# Altium project MotorTreiber.PrjPcb
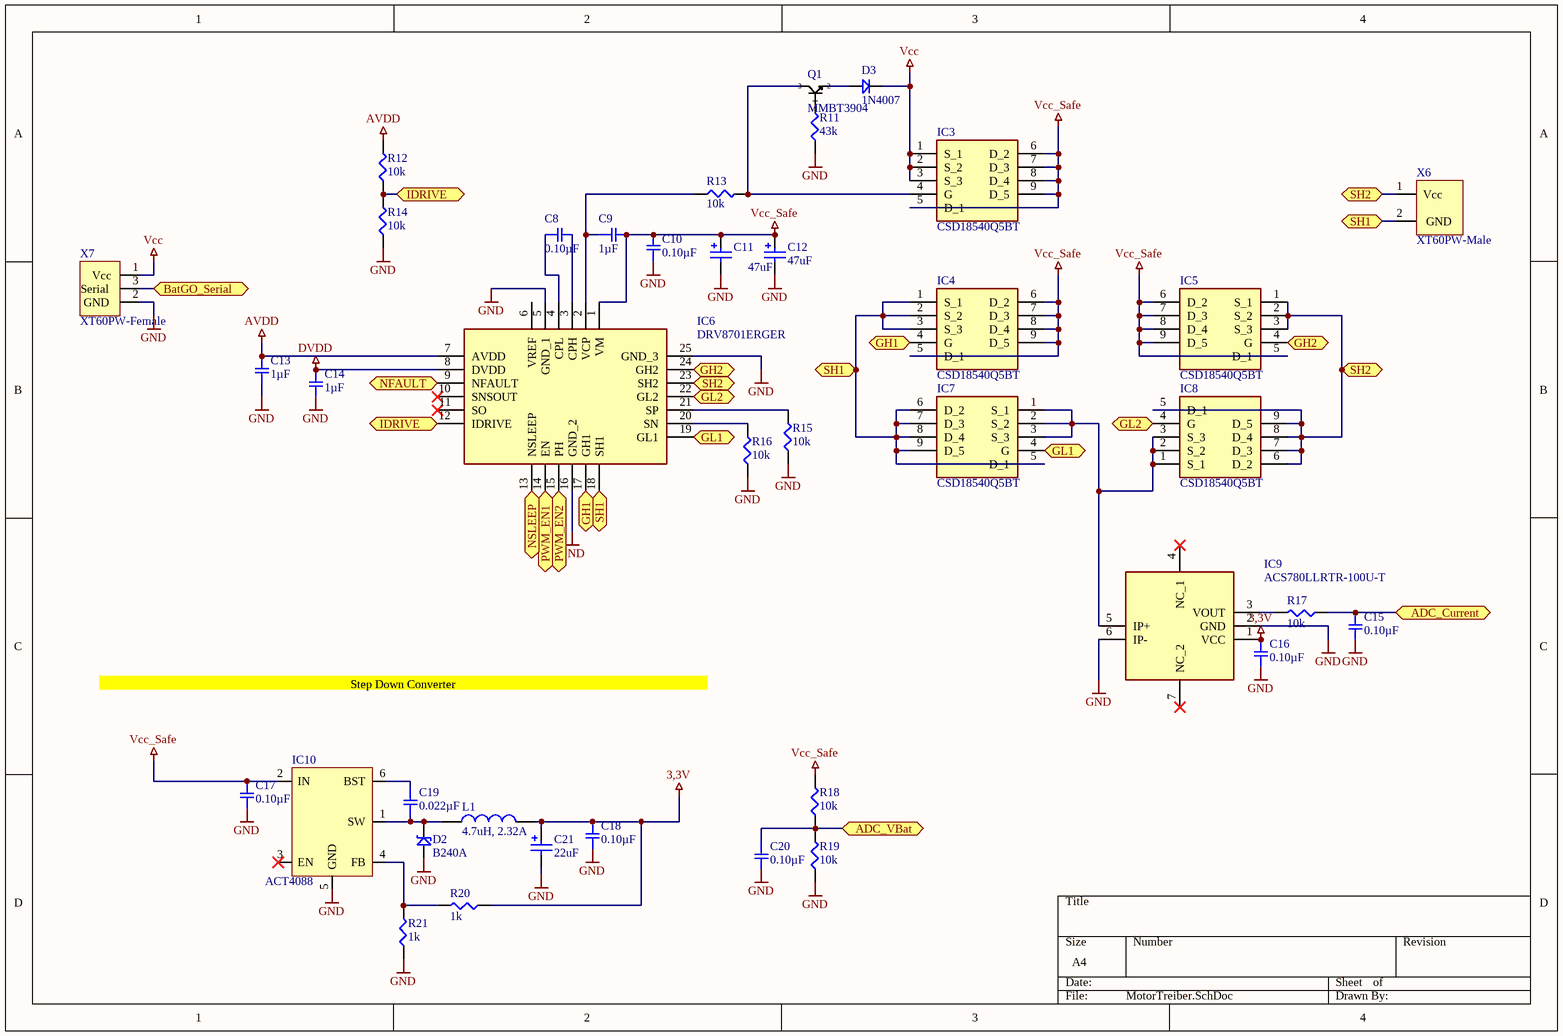
[diagram p0: MotorTreiber.SchDoc]
2 sheets, 73 parts. Net scope: flat (ports and power ports of the same name join across sheets).
Board file: Motortreiber.PcbDoc
Sheets:
  MotorTreiber.SchDoc
  MotorTreiber-µC.SchDoc

## Sheet MotorTreiber.SchDoc
size A4

### Parts
C8  0.10µF  [SMD-0402C]
C9  1µF  [SMD-0402C]
C10  0.10µF  [SMD-0402C]
C11  value 47uF  [WCAP-ASLI_6.3x7.7]  (hidden comment: 865080645012)
C12  value 47uF  [WCAP-ASLI_6.3x7.7]  (hidden comment: 865080645012)
C13  1µF  [SMD-0402C]
C14  1µF  [SMD-0402C]
C15  0.10µF  [SMD-0402C]
C16  0.10µF  [SMD-0402C]
C17  0.10µF  [SMD-0402C]
C18  0.10µF  [SMD-0402C]
C19  0.022µF  [SMD-0603C]
C20  0.10µF  [SMD-0402C]
C21  value 22uF  [WCAP-ASLI_4x5.5]  (hidden comment: 865080140001)
D2  B240A  [B240A]
D3  1N4007  [SOD-323]
IC3  CSD18540Q5BT  [CSD18540Q5BT]
IC4  CSD18540Q5BT  [CSD18540Q5BT]
IC5  CSD18540Q5BT  [CSD18540Q5BT]
IC6  DRV8701ERGER  [QFN50P400X400X100-25N-D]
IC7  CSD18540Q5BT  [CSD18540Q5BT]
IC8  CSD18540Q5BT  [CSD18540Q5BT]
IC9  ACS780LLRTR-100U-T  [7-PIN_PSOF]
IC10  ACT4088  [SOT23-6]
L1  4.7uH, 2.32A  [WE-PD_7332]
Q1  MMBT3904  [SOT23]
R11  43k  [SMD-0402-RES]
R12  10k  [SMD-0402-RES]
R13  10k  [SMD-0402-RES]
R14  10k  [SMD-0402-RES]
R15  10k  [SMD-0402-RES]
R16  10k  [SMD-0402-RES]
R17  10k  [SMD-0402-RES]
R18  10k  [SMD-0402-RES]
R19  10k  [SMD-0402-RES]
R20  1k  [SMD-0603-RES]
R21  1k  [SMD-0603-RES]
X6  XT60PW-Male  [XT60PW_Male]
X7  XT60PW-Female  [XT60PWI-M_Female]

### Ports
ADC_Current (bidir), ADC_VBat (bidir), BatGO_Serial (bidir), GH1 (bidir), GH2 (bidir), GL1 (bidir), GL2 (bidir), IDRIVE (bidir), NFAULT (bidir), NSLEEP (bidir), PWM_EN1 (bidir), PWM_EN2 (bidir), SH1 (bidir), SH2 (bidir)

### Nets
3,3V: C16.1 C18.1 C21.1(P) IC9.1(VCC) L1.2 R20.1
AVDD: C13.1 IC6.7(AVDD) R12.2
DVDD: C14.1 IC6.8(DVDD)
GND: C10.1 C11.2(N) C12.2(N) C13.2 C14.2 C15.2 C16.2 C17.2 C18.2 C20.2 C21.2(N) D2.A IC6.5(GND_1) IC6.16(GND_2) IC6.25(GND_3) IC9.2(GND) IC9.6(IP-) IC10.5(GND) R11.1 R14.1 R15.1 R16.1 R19.1 R21.1 X7.2(GND)
Vcc: D3.K IC3.1(S_1) IC3.2(S_2) IC3.3(S_3) X7.1(Vcc)
Vcc_Safe: C9.2 C10.2 C11.1(P) C12.1(P) C17.1 IC3.5(D_1) IC3.6(D_2) IC3.7(D_3) IC3.8(D_4) IC3.9(D_5) IC4.5(D_1) IC4.6(D_2) IC4.7(D_3) IC4.8(D_4) IC4.9(D_5) IC5.5(D_1) IC5.6(D_2) IC5.7(D_3) IC5.8(D_4) IC5.9(D_5) IC6.1(VM) IC10.2(IN) R18.2
NetC8_1: C8.1 IC6.4(CPL)
NetC8_2: C8.2 IC6.3(CPH)
NetC9_1: C9.1 IC6.2(VCP) R13.1
NetC15_1: C15.1 R17.1 ; port ADC_Current
NetC19_1: C19.1 IC10.6(BST)
NetC19_2: C19.2 D2.K IC10.1(SW) L1.1
NetC20_1: C20.1 R18.1 R19.2 ; port ADC_VBat
NetD3_A: D3.A Q1.S(2)
NetIC2_13: IC6.15(PH) ; port PWM_EN2
NetIC2_14: IC6.14(EN) ; port PWM_EN1
NetIC2_15: IC6.13(NSLEEP) ; port NSLEEP
NetIC2_16: IC6.9(NFAULT) ; port NFAULT
NetIC2_21: X7.3(Serial) ; port BatGO_Serial
NetIC3_4: IC3.4(G) Q1.D(3) R13.2
NetIC4_1: IC4.1(S_1) IC4.2(S_2) IC4.3(S_3) IC6.18(SH1) IC7.5(D_1) IC7.6(D_2) IC7.7(D_3) IC7.8(D_4) IC7.9(D_5) X6.2(GND) ; port SH1
NetIC4_4: IC4.4(G) IC6.17(GH1) ; port GH1
NetIC5_1: IC5.1(S_1) IC5.2(S_2) IC5.3(S_3) IC6.23(SH2) IC8.5(D_1) IC8.6(D_2) IC8.7(D_3) IC8.8(D_4) IC8.9(D_5) X6.1(Vcc) ; port SH2
NetIC5_4: IC5.4(G) IC6.24(GH2) ; port GH2
NetIC6_12: IC6.12(IDRIVE) R12.1 R14.2 ; port IDRIVE
NetIC6_19: IC6.19(GL1) IC7.4(G) ; port GL1
NetIC6_20: IC6.20(SN) R16.2
NetIC6_21: IC6.21(SP) R15.2
NetIC6_22: IC6.22(GL2) IC8.4(G) ; port GL2
NetIC7_1: IC7.1(S_1) IC7.2(S_2) IC7.3(S_3) IC8.1(S_1) IC8.2(S_2) IC8.3(S_3) IC9.5(IP+)
NetIC9_3: IC9.3(VOUT) R17.2
NetIC10_4: IC10.4(FB) R20.2 R21.2
NetQ1_G: Q1.G(1) R11.2

Not connected (* = marked no-connect by the designer): IC6 6(VREF) 10(SNSOUT)* 11(SO)*; IC9 4(NC_1)* 7(NC_2)*; IC10 3(EN)*

### Notes on the sheet
- Step Down Converter

### Library data of the parts
C8 C10 C15-C18 C20 = GCM155R71C104KA55D: CAP CER 0.1UF 16V X7R 0402; Manufacturer: Murata Electronics North America; Factory Stock: 0; Unit Price (USD): 0.1; Minimum Quantity: 1; Tolerance: ±10%; Datasheets: http://www.murata.com/~/media/webrenewal/support/library/catalog/products/capacitor/mlcc/c03e.ashx; Image: //media.digikey.com/Renders/Murata%20Renders/ZRB-SERIES-0402.jpg; Digi-Key Part Number: 490-4759-1-ND; Part Number: GCM155R71C104KA55D; Quantity Available: 734194; @ qty: 0; Packaging: Cut Tape (CT); Series: GCM; Part Status: Active; Value: 0.10µF; Voltage: 16V; Temperature Coefficient: X7R; Operating Temperature: -55°C ~ 125°C; Features: -; Ratings: AEC-Q200; Applications: Automotive; Mounting Type: Surface Mount, MLCC; Package / Case: 0402 (1005 Metric); Size / Dimension: 0.039" L x 0.020" W (1.00mm x 0.50mm); Height - Seated (Max): -; Thickness (Max): 0.022" (0.55mm); Lead Spacing: -; Lead Style: -
C9 C13 C14 = GRM155C80J105KE02D: CAP CER 1UF 6.3V X6S 0402; Manufacturer: Murata Electronics North America; Factory Stock: 0; Unit Price (USD): 0.1; Minimum Quantity: 1; Tolerance: ±10%; Datasheets: http://www.murata.com/~/media/webrenewal/support/library/catalog/products/capacitor/mlcc/c02e.pdf; Image: //media.digikey.com/Renders/Murata%20Renders/ZRB-SERIES-0402.jpg; Digi-Key Part Number: 490-10433-1-ND; Part Number: GRM155C80J105KE02D; Quantity Available: 34510; @ qty: 0; Packaging: Cut Tape (CT); Series: GRM; Part Status: Active; Value: 1µF; Voltage: 6.3V; Temperature Coefficient: X6S; Operating Temperature: -55°C ~ 105°C; Features: Derating Recommended; Ratings: -; Applications: General Purpose; Mounting Type: Surface Mount, MLCC; Package / Case: 0402 (1005 Metric); Size / Dimension: 0.039" L x 0.020" W (1.00mm x 0.50mm); Height - Seated (Max): -; Thickness (Max): 0.022" (0.55mm); Lead Spacing: -; Lead Style: -
C11 C12 = 865080645012: WCAP-ASLI Aluminum Electrolytic Capacitors, size Ф6.3x7.7mm, 50V DC, 47uF; Rated Voltage: 50V DC; ComponentLink1Description: Manufacturer; ComponentLink1URL: http://www.we-online.de; ComponentLink2Description: Datasheet; ComponentLink2URL: http://katalog.we-online.de/pbs/datasheet/865080645012.pdf; Part Number: 865080645012; Published Date: June 2017; Publisher: Wurth Elektronik; Size: Ф6.3x7.7mm; Life Cycle: 2000h; Operating Temperature: -55 °C up to +105 °C
C19 = GCJ188R71H223KA01D: CAP CER 0.022UF 50V X7R 0603; Manufacturer: Murata Electronics North America; Factory Stock: 0; Unit Price (USD): 0.22; Minimum Quantity: 1; Tolerance: ±10%; Datasheets: http://www.murata.com/~/media/webrenewal/support/library/catalog/products/capacitor/mlcc/c03e.ashx; Image: //media.digikey.com/Renders/Murata%20Renders/0603%28LQG18%29.jpg; Digi-Key Part Number: 490-5851-1-ND; Part Number: GCJ188R71H223KA01D; Quantity Available: 7651; @ qty: 0; Packaging: Cut Tape (CT); Series: GCJ; Part Status: Active; Value: 0.022µF; Voltage: 50V; Temperature Coefficient: X7R; Operating Temperature: -55°C ~ 125°C; Features: Soft Termination; Ratings: AEC-Q200; Applications: Automotive, Boardflex Sensitive; Mounting Type: Surface Mount, MLCC; Package / Case: 0603 (1608 Metric); Size / Dimension: 0.063" L x 0.031" W (1.60mm x 0.80mm); Height - Seated (Max): -; Thickness (Max): 0.031" (0.80mm); Lead Spacing: -; Lead Style: -
C21 = 865080140001: WCAP-ASLI Aluminum Electrolytic Capacitors, size Ф4x5.5mm, 6.3V DC, 22uF; Rated Voltage: 6.3V DC; ComponentLink1Description: Manufacturer; ComponentLink1URL: http://www.we-online.de; ComponentLink2Description: Datasheet; ComponentLink2URL: http://katalog.we-online.de/pbs/datasheet/865080140001.pdf; Part Number: 865080140001; Published Date: June 2017; Publisher: Wurth Elektronik; Size: Ф4x5.5mm; Life Cycle: 2000h; Operating Temperature: -55 °C up to +105 °C
D2 = B240A: Shottkydiode
IC3-IC5 IC7 IC8 = CSD18540Q5BT: Integrated Circuit; Manufacturer_Name: Texas Instruments; Datasheet Link: http://www.ti.com/lit/gpn/CSD18540Q5B; Height: 1.05mm; Manufacturer_Part_Number: CSD18540Q5BT; Arrow Part Number: CSD18540Q5BT; Arrow Price/Stock: https://www.arrow.com/en/products/csd18540q5bt/texas-instruments; Mouser Part Number: 595-CSD18540Q5BT; Mouser Price/Stock: https://www.mouser.co.uk/ProductDetail/Texas-Instruments/CSD18540Q5BT?qs=NRIcxvoDUteGYlfdfF0DmQ%3D%3D
IC6 = DRV8701ERGER: Integrated Circuit; Manufacturer_Name: Texas Instruments; Datasheet Link: http://www.ti.com/lit/gpn/DRV8701; Height: 1mm; Manufacturer_Part_Number: DRV8701ERGER; Arrow Part Number: DRV8701ERGER; Arrow Price/Stock: https://www.arrow.com/en/products/drv8701erger/texas-instruments; Mouser Part Number: 595-DRV8701ERGER; Mouser Price/Stock: https://www.mouser.co.uk/ProductDetail/Texas-Instruments/DRV8701ERGER?qs=UfUFg%2FkmHHGO0gqJCiEBBQ%3D%3D
IC9 = ACS780LLRTR-100U-T: Integrated Circuit; Manufacturer_Name: Allegro Microsystems; Datasheet Link: https://www.allegromicro.com/~/media/Files/Datasheets/ACS780-Datasheet.ashx; Manufacturer_Part_Number: ACS780LLRTR-100U-T; Arrow Part Number: ACS780LLRTR-100U-T; Arrow Price/Stock: https://www.arrow.com/en/products/acs780llrtr-100u-t/allegro-microsystems
L1 = 744778004: WE-PD SMT Power Inductor, size 7332, 4.7uH, 2.32A; DC Resistance max.: 60mOhm; Self Resonant Frequency: 45MHz; Saturation Current: 4.2A; ComponentLink1Description: Manufacturer; ComponentLink1URL: http://www.we-online.de; ComponentLink2Description: Datasheet; ComponentLink2URL: https://katalog.we-online.com/pbs/datasheet/744778004.pdf; Part Number: 744778004; Published Date: April 2019; Publisher: Wurth Elektronik; Rated Current: 2.32A; Size: 7332; Inductance: 4.7uH; Operating Temperature: -40 to +125degC; Mounting Technology: SMT; Packaging: Tape and Reel
R11 = ERJ-2GEJ433X: RES SMD 43K OHM 5% 1/10W 0402; Manufacturer: Panasonic Electronic Components; Factory Stock: 0; Unit Price (USD): 0.00350; @ qty: 1500; Minimum Quantity: 1; Power (Watts): 0.1W, 1/10W; Temperature Coefficient: ±200ppm/°C; Part Number: ERJ-2GEJ433X; Datasheets: http://industrial.panasonic.com/www-cgi/jvcr13pz.cgi?E+PZ+3+AOA0001+ERJ2GEJ433X+7+WW; Image: //media.digikey.com/Photos/Panasonic%20Photos/ERJ-PA2-Series.jpg; Digi-Key Part Number: P43KJCT-ND; Quantity Available: 117636; Packaging: Cut Tape (CT); Series: ERJ; Part Status: Active; Value: 43k; Tolerance: ±5%; Composition: Thick Film; Features: Automotive AEC-Q200; Operating Temperature: -55°C ~ 155°C; Package / Case: 0402 (1005 Metric); Supplier Device Package: 0402; Size / Dimension: 0.039" L x 0.020" W (1.00mm x 0.50mm); Height - Seated (Max): 0.016" (0.40mm); Number of Terminations: 2; Failure Rate: -
R12-R19 = ERJ-2GEJ103X: RES SMD 10K OHM 5% 1/10W 0402; Manufacturer: Panasonic Electronic Components; Factory Stock: 0; Unit Price (USD): 0.00350; @ qty: 1500; Minimum Quantity: 1; Power (Watts): 0.1W, 1/10W; Temperature Coefficient: ±200ppm/°C; Part Number: ERJ-2GEJ103X; Datasheets: http://industrial.panasonic.com/www-cgi/jvcr13pz.cgi?E+PZ+3+AOA0001+ERJ2GEJ103X+7+WW; Image: //media.digikey.com/Photos/Panasonic%20Photos/ERJ-PA2-Series.jpg; Digi-Key Part Number: P10KJCT-ND; Quantity Available: 2560215; Packaging: Cut Tape (CT); Series: ERJ; Part Status: Active; Value: 10k; Tolerance: ±5%; Composition: Thick Film; Features: Automotive AEC-Q200; Operating Temperature: -55°C ~ 155°C; Package / Case: 0402 (1005 Metric); Supplier Device Package: 0402; Size / Dimension: 0.039" L x 0.020" W (1.00mm x 0.50mm); Height - Seated (Max): 0.016" (0.40mm); Number of Terminations: 2; Failure Rate: -
R20 R21 = ERJ-3EKF1001V: RES SMD 1K OHM 1% 1/10W 0603; Manufacturer: Panasonic Electronic Components; Factory Stock: 0; Unit Price (USD): 0.00379; @ qty: 1500; Minimum Quantity: 1; Power (Watts): 0.1W, 1/10W; Temperature Coefficient: ±100ppm/°C; Part Number: ERJ-3EKF1001V; Datasheets: http://industrial.panasonic.com/www-cgi/jvcr13pz.cgi?E+PZ+3+AOA0002+ERJ3EKF1001V+7+WW; Image: //media.digikey.com/Photos/Panasonic%20Photos/MFG_ERJ-P6W%20Series.jpg; Digi-Key Part Number: P1.00KHCT-ND; Quantity Available: 5218845; Packaging: Cut Tape (CT); Series: ERJ; Part Status: Active; Value: 1k; Tolerance: ±1%; Composition: Thick Film; Features: Automotive AEC-Q200; Operating Temperature: -55°C ~ 155°C; Package / Case: 0603 (1608 Metric); Supplier Device Package: 0603; Size / Dimension: 0.063" L x 0.031" W (1.60mm x 0.80mm); Height - Seated (Max): 0.022" (0.55mm); Number of Terminations: 2; Failure Rate: -

## Sheet MotorTreiber-µC.SchDoc
size A4
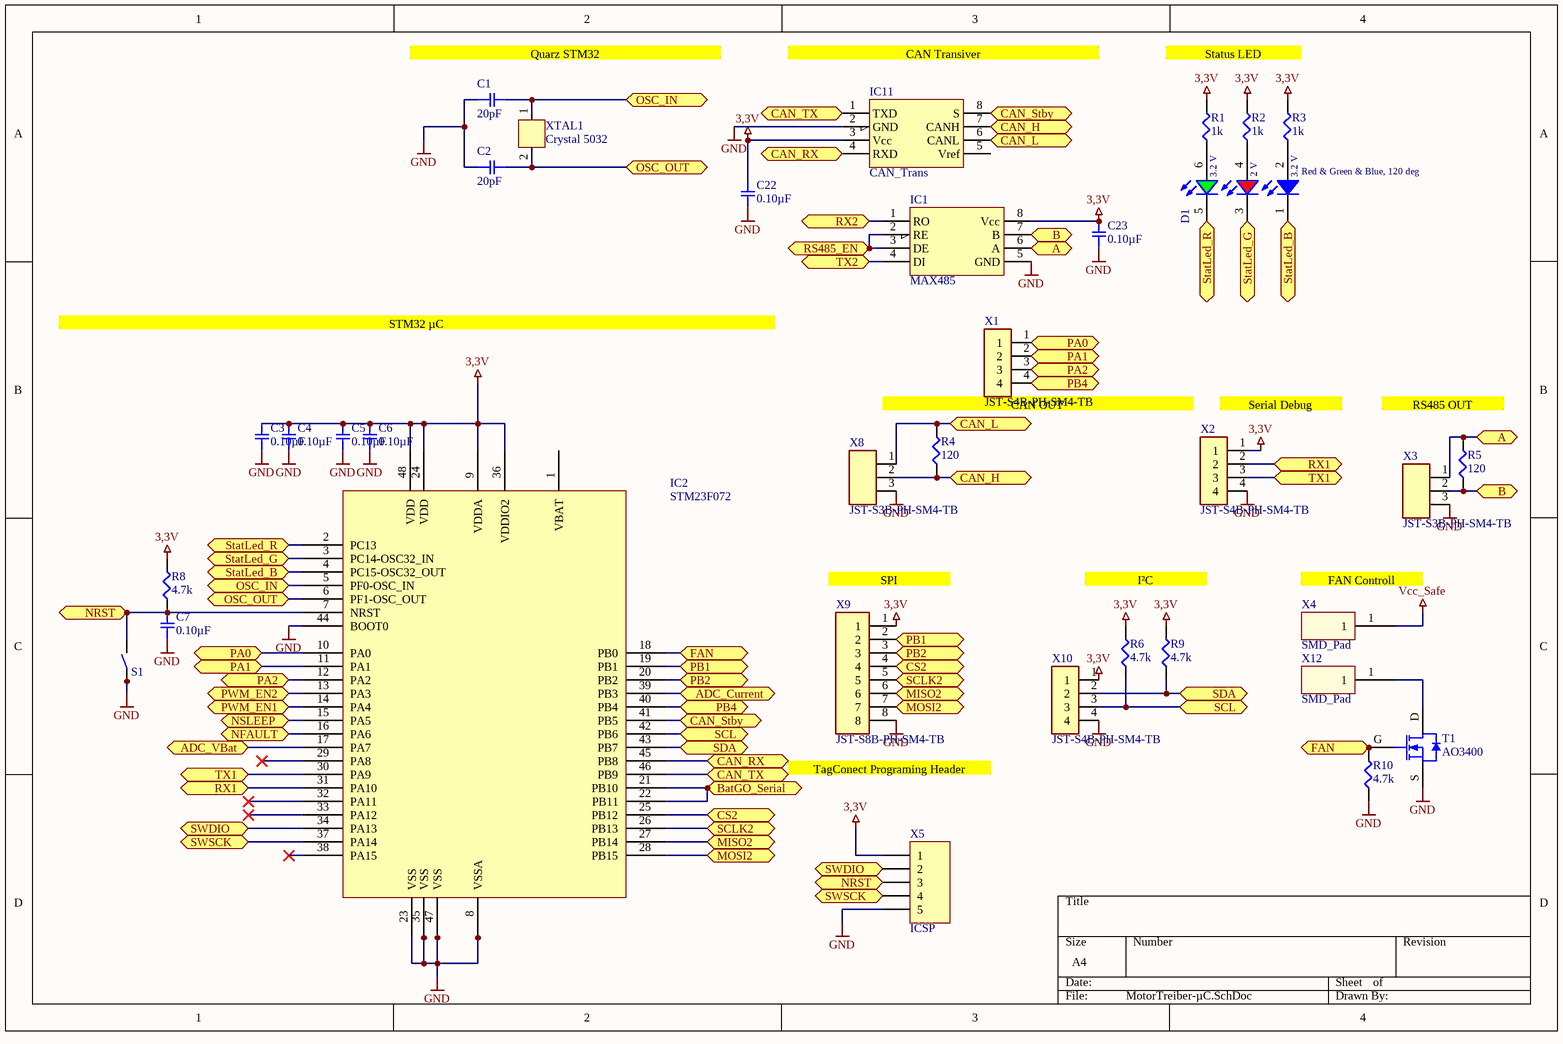
[diagram p1: MotorTreiber-µC.SchDoc]

### Parts
C1  20pF  [SMD-0402C]
C2  20pF  [SMD-0402C]
C3  0.10µF  [SMD-0402C]
C4  0.10µF  [SMD-0402C]
C5  0.10µF  [SMD-0402C]
C6  0.10µF  [SMD-0402C]
C7  0.10µF  [SMD-0402C]
C22  0.10µF  [SMD-0402C]
C23  0.10µF  [SMD-0402C]
D1  Red & Green & Blue, 120 deg  [WL-SFTW_3528_150352M173300]
IC1  MAX485  [D008_L]
IC2  STM23F072  [UFQFPN48]
IC11  CAN_Trans  [D008_L]
R1  1k  [SMD-0402-RES]
R2  1k  [SMD-0402-RES]
R3  1k  [SMD-0402-RES]
R4  120  [SMD-0402-RES]
R5  120  [SMD-0402-RES]
R6  4.7k  [SMD-0402-RES]
R8  4.7k  [SMD-0402-RES]
R9  4.7k  [SMD-0402-RES]
R10  4.7k  [SMD-0402-RES]
S1  Button  [Button5050]  (value not drawn)
T1  AO3400  [SOT23]
X1  JST-S4B-PH-SM4-TB  [JST-S4B-PH-SM4-TB]
X2  JST-S4B-PH-SM4-TB  [JST-S4B-PH-SM4-TB]
X3  JST-S3B-PH-SM4-TB  [JST-S3B-PH-SM4-TB]
X4  SMD_Pad  [SMD_Pad]
X5  ICSP  [TC2030-MCP-NL]
X8  JST-S3B-PH-SM4-TB  [JST-S3B-PH-SM4-TB]
X9  JST-S8B-PH-SM4-TB  [JST-S8B-PH-SM4-TB]
X10  JST-S4B-PH-SM4-TB  [JST-S4B-PH-SM4-TB]
X12  SMD_Pad  [SMD_Pad]
XTAL1  Crystal 5032  [5032]

### Ports
A (bidir), ADC_Current (bidir), ADC_VBat (bidir), B (bidir), BatGO_Serial (bidir), CAN_H (bidir), CAN_L (bidir), CAN_RX (bidir), CAN_Stby (bidir), CAN_TX (bidir), CS2 (bidir), FAN (bidir), MISO2 (bidir), MOSI2 (bidir), NFAULT (bidir), NRST (bidir), NSLEEP (bidir), OSC_IN (bidir), OSC_OUT (bidir), PA0 (bidir), PA1 (bidir), PA2 (bidir), PB1 (bidir), PB2 (bidir), PB4 (bidir), PWM_EN1 (bidir), PWM_EN2 (bidir), RS485_EN (bidir), RX1 (bidir), RX2 (bidir), SCL (bidir), SCLK2 (bidir), SDA (bidir), StatLed_B (bidir), StatLed_G (bidir), StatLed_R (bidir), SWDIO (bidir), SWSCK (bidir), TX1 (bidir), TX2 (bidir)

### Nets
3,3V: C3.2 C4.2 C5.2 C6.2 C22.2 C23.2 IC1.8(Vcc) IC2.9(VDDA) IC2.24(VDD) IC2.36(VDDIO2) IC2.48(VDD) IC11.3(Vcc) R1.2 R2.2 R3.2 R6.2 R8.2 R9.2 X2.1 X5.1 X9.1 X10.1
GND: C1.1 C2.1 C3.1 C4.1 C5.1 C6.1 C7.1 C22.1 C23.1 IC1.5(GND) IC2.8(VSSA) IC2.23(VSS) IC2.35(VSS) IC2.44(BOOT0) IC2.47(VSS) IC11.2(GND) R10.1 S1.1 T1.S X2.4 X3.3 X5.5 X8.3 X9.8 X10.4
Vcc_Safe: X4.1
NetC1_2: C1.2 IC2.5(PF0-OSC_IN) XTAL1.1 ; port OSC_IN
NetC2_2: C2.2 IC2.6(PF1-OSC_OUT) XTAL1.2 ; port OSC_OUT
NetC7_2: C7.2 IC2.7(NRST) R8.1 S1.2 X5.3 ; port NRST
NetC15_1: IC2.39(PB3) ; port ADC_Current
NetC20_1: IC2.17(PA7) ; port ADC_VBat
NetD1_1: D1.1(K) IC2.4(PC15-OSC32_OUT) ; port StatLed_B
NetD1_2: D1.2(A) R3.1
NetD1_3: D1.3(K) IC2.3(PC14-OSC32_IN) ; port StatLed_G
NetD1_4: D1.4(A) R2.1
NetD1_5: D1.5(K) IC2.2(PC13) ; port StatLed_R
NetD1_6: D1.6(A) R1.1
NetIC1_1: IC1.1(RO) ; port RX2
NetIC1_2: IC1.2(RE) IC1.3(DE) ; port RS485_EN
NetIC1_4: IC1.4(DI) ; port TX2
NetIC1_6: IC1.6(A) R5.2 X3.1 ; port A
NetIC1_7: IC1.7(B) R5.1 X3.2 ; port B
NetIC2_10: IC2.10(PA0) X1.1 ; port PA0
NetIC2_11: IC2.11(PA1) X1.2 ; port PA1
NetIC2_12: IC2.12(PA2) X1.3 ; port PA2
NetIC2_13: IC2.13(PA3) ; port PWM_EN2
NetIC2_14: IC2.14(PA4) ; port PWM_EN1
NetIC2_15: IC2.15(PA5) ; port NSLEEP
NetIC2_16: IC2.16(PA6) ; port NFAULT
NetIC2_18: IC2.18(PB0) R10.2 T1.G ; port FAN
NetIC2_19: IC2.19(PB1) X9.2 ; port PB1
NetIC2_20: IC2.20(PB2) X9.3 ; port PB2
NetIC2_21: IC2.21(PB10) IC2.22(PB11) ; port BatGO_Serial
NetIC2_25: IC2.25(PB12) X9.4 ; port CS2
NetIC2_26: IC2.26(PB13) X9.5 ; port SCLK2
NetIC2_27: IC2.27(PB14) X9.6 ; port MISO2
NetIC2_28: IC2.28(PB15) X9.7 ; port MOSI2
NetIC2_30: IC2.30(PA9) X2.3 ; port TX1
NetIC2_31: IC2.31(PA10) X2.2 ; port RX1
NetIC2_34: IC2.34(PA13) X5.2 ; port SWDIO
NetIC2_37: IC2.37(PA14) X5.4 ; port SWSCK
NetIC2_40: IC2.40(PB4) X1.4 ; port PB4
NetIC2_41: IC2.41(PB5) IC11.8(S) ; port CAN_Stby
NetIC2_42: IC2.42(PB6) R6.1 X10.3 ; port SCL
NetIC2_43: IC2.43(PB7) R9.1 X10.2 ; port SDA
NetIC2_45: IC2.45(PB8) IC11.4(RXD) ; port CAN_RX
NetIC2_46: IC2.46(PB9) IC11.1(TXD) ; port CAN_TX
NetIC11_6: IC11.6(CANL) R4.2 X8.1 ; port CAN_L
NetIC11_7: IC11.7(CANH) R4.1 X8.2 ; port CAN_H
NetT1_D: T1.D X12.1

Not connected (* = marked no-connect by the designer): IC2 1(VBAT) 29(PA8)* 32(PA11)* 33(PA12)* 38(PA15)*; IC11 5(Vref)

### Notes on the sheet
- Quarz STM32
- CAN Transiver
- Status LED
- STM32 µC
  STM32 µC
- (near X1) CAN OUT
- (near X2) Serial Debug
- (near R5) RS485 OUT
- (near X9) SPI
- I²C
- (near X4) FAN Controll
- (near X9) TagConect Programing Header
- (in symbol 150352M173300) 3.2 V; 2 V

### Library data of the parts
C1 C2 = GJM1555C1H200GB01D: CAP CER 20PF 50V NP0 0402; Manufacturer: Murata Electronics North America; Factory Stock: 0; Unit Price (USD): 0.2; Minimum Quantity: 1; Tolerance: ±2%; Temperature Coefficient: C0G, NP0; Datasheets: http://www.murata.com/~/media/webrenewal/support/library/catalog/products/capacitor/mlcc/c02e.pdf; Image: //media.digikey.com/Renders/Murata%20Renders/ZRB-SERIES-0402.jpg; Digi-Key Part Number: 490-8090-1-ND; Part Number: GJM1555C1H200GB01D; Quantity Available: 18876; @ qty: 0; Packaging: Cut Tape (CT); Series: GJM; Part Status: Active; Value: 20pF; Voltage: 50V; Operating Temperature: -55°C ~ 125°C; Features: High Q, Low Loss; Ratings: -; Applications: RF, Microwave, High Frequency; Mounting Type: Surface Mount, MLCC; Package / Case: 0402 (1005 Metric); Size / Dimension: 0.039" L x 0.020" W (1.00mm x 0.50mm); Height - Seated (Max): -; Thickness (Max): 0.022" (0.55mm); Lead Spacing: -; Lead Style: -
C3-C7 C22 C23 = GCM155R71C104KA55D: as C8 on sheet MotorTreiber; Datasheets: http://www.murata.com/~/media/webrenewal/support/library/catalog/products/capacitor/mlcc/c03e.ashx; Image: //media.digikey.com/Renders/Murata%20Renders/ZRB-SERIES-0402.jpg; Digi-Key Part Number: 490-4759-1-ND; Part Number: GCM155R71C104KA55D; Quantity Available: 734194; @ qty: 0; Packaging: Cut Tape (CT); Series: GCM; Part Status: Active; Value: 0.10µF; Voltage: 16V; Temperature Coefficient: X7R; Operating Temperature: -55°C ~ 125°C; Features: -; Ratings: AEC-Q200; Applications: Automotive; Mounting Type: Surface Mount, MLCC; Package / Case: 0402 (1005 Metric); Size / Dimension: 0.039" L x 0.020" W (1.00mm x 0.50mm); Height - Seated (Max): -; Thickness (Max): 0.022" (0.55mm); Lead Spacing: -; Lead Style: -
D1 = 150352M173300: SMT Full-color TOP LED Waterclear WL-SFTW, size 3528, Red & Green & Blue, 120 deg; Viewing Angle: 120 deg; Peak Wavelength: 465 nm@Blue, 515 nm@Green, 635 nm@Red; Dominant Wavelength: 470 nm@Blue, 520 nm@Green, 625 nm@Red; Luminous Intensity: 400 mcd@Blue, 1700 mcd@Green, 750 mcd@Red; Chip Technology: AlInGaP + InGaN; Forward Voltage: 3.2 V@Blue, 3.2 V@Green, 2 V@Red; ComponentLink1Description: Manufacturer; ComponentLink1URL: http://www.we-online.de; ComponentLink2Description: Datasheet; ComponentLink2URL: https://katalog.we-online.de/led/datasheet/150352M173300.pdf; Part Number: 150352M173300; Published Date: December 2018; Publisher: Wurth Elektronik; Size: 3528; Operating Temperature: -40 to +85 degC; Emitting Color: Red & Green & Blue; Mounting Technology: SMT; Packaging: Tape and Reel
IC2 = STM32F072C8U6
R1-R3 = ERJ-2GEJ102X: RES SMD 1K OHM 5% 1/10W 0402; Manufacturer: Panasonic Electronic Components; Factory Stock: 0; Unit Price (USD): 0.00350; @ qty: 1500; Minimum Quantity: 1; Power (Watts): 0.1W, 1/10W; Temperature Coefficient: ±200ppm/°C; Part Number: ERJ-2GEJ102X; Datasheets: http://industrial.panasonic.com/www-cgi/jvcr13pz.cgi?E+PZ+3+AOA0001+ERJ2GEJ102X+7+WW; Image: //media.digikey.com/Photos/Panasonic%20Photos/ERJ-PA2-Series.jpg; Digi-Key Part Number: P1.0KJCT-ND; Quantity Available: 1939857; Packaging: Cut Tape (CT); Series: ERJ; Part Status: Active; Value: 1k; Tolerance: ±5%; Composition: Thick Film; Features: Automotive AEC-Q200; Operating Temperature: -55°C ~ 155°C; Package / Case: 0402 (1005 Metric); Supplier Device Package: 0402; Size / Dimension: 0.039" L x 0.020" W (1.00mm x 0.50mm); Height - Seated (Max): 0.016" (0.40mm); Number of Terminations: 2; Failure Rate: -
R4 R5 = ERJ-2RKF1200X: RES SMD 120 OHM 1% 1/10W 0402; Manufacturer: Panasonic Electronic Components; Factory Stock: 0; Unit Price (USD): 0.00496; @ qty: 1500; Minimum Quantity: 1; Power (Watts): 0.1W, 1/10W; Temperature Coefficient: ±100ppm/°C; Part Number: ERJ-2RKF1200X; Datasheets: http://industrial.panasonic.com/www-cgi/jvcr13pz.cgi?E+PZ+3+AOA0002+ERJ2RKF1200X+7+WW; Image: //media.digikey.com/Photos/Panasonic%20Photos/ERJ-PA2-Series.jpg; Digi-Key Part Number: P120LCT-ND; Quantity Available: 258171; Packaging: Cut Tape (CT); Series: ERJ; Part Status: Active; Value: 120; Tolerance: ±1%; Composition: Thick Film; Features: Automotive AEC-Q200; Operating Temperature: -55°C ~ 155°C; Package / Case: 0402 (1005 Metric); Supplier Device Package: 0402; Size / Dimension: 0.039" L x 0.020" W (1.00mm x 0.50mm); Height - Seated (Max): 0.016" (0.40mm); Number of Terminations: 2; Failure Rate: -
R6 R8-R10 = ERJ-2GEJ472X: RES SMD 4.7K OHM 5% 1/10W 0402; Manufacturer: Panasonic Electronic Components; Factory Stock: 0; Unit Price (USD): 0.00350; @ qty: 1500; Minimum Quantity: 1; Power (Watts): 0.1W, 1/10W; Temperature Coefficient: ±200ppm/°C; Part Number: ERJ-2GEJ472X; Datasheets: http://industrial.panasonic.com/www-cgi/jvcr13pz.cgi?E+PZ+3+AOA0001+ERJ2GEJ472X+7+WW; Image: //media.digikey.com/Photos/Panasonic%20Photos/ERJ-PA2-Series.jpg; Digi-Key Part Number: P4.7KJCT-ND; Quantity Available: 8551774; Packaging: Cut Tape (CT); Series: ERJ; Part Status: Active; Value: 4.7k; Tolerance: ±5%; Composition: Thick Film; Features: Automotive AEC-Q200; Operating Temperature: -55°C ~ 155°C; Package / Case: 0402 (1005 Metric); Supplier Device Package: 0402; Size / Dimension: 0.039" L x 0.020" W (1.00mm x 0.50mm); Height - Seated (Max): 0.016" (0.40mm); Number of Terminations: 2; Failure Rate: -
S1 = Button: 6.1x3.7x2.5mm
T1 = AO3400: AO3400 MOSFET 30V
X1 X2 X10 = JST-S4B-PH-SM4-TB: JST Connector; Manufacturer_Name: JST (JAPAN SOLDERLESS TERMINALS); Manufacturer_Part_Number: B4B-PH-SM3-TB; Datasheet Link: http://media.digikey.com/pdf/Data%20Sheets/JST%20PDFs/PH%20Series.pdf; Height: 6.6mm; Arrow Part Number: B4B-PH-SM3-TB
X3 X8 = JST-S3B-PH-SM4-TB: JST Connector
X9 = JST-S8B-PH-SM4-TB: JST Connector; Manufacturer_Name: JST (JAPAN SOLDERLESS TERMINALS); Manufacturer_Part_Number: B8B-PH-SM4-TB(LF)(SN); Datasheet Link: http://uk.rs-online.com/web/p/products/6881347; Arrow Part Number: B8B-PH-SM4-TB(LF)(SN); Arrow Price/Stock: https://www.arrow.com/en/products/b8b-ph-sm4-tb-lf-sn/jst-manufacturing
XTAL1 = 5032

## Nets that join several sheets
3,3V: MotorTreiber (6 pins), MotorTreiber-µC (22 pins)
GND: MotorTreiber (25 pins), MotorTreiber-µC (25 pins)
Vcc_Safe: MotorTreiber (23 pins), MotorTreiber-µC (X4.1)
NetC15_1: MotorTreiber (C15.1 R17.1), MotorTreiber-µC (IC2.39)
NetC20_1: MotorTreiber (C20.1 R18.1 R19.2), MotorTreiber-µC (IC2.17)
NetIC2_13: MotorTreiber (IC6.15), MotorTreiber-µC (IC2.13)
NetIC2_14: MotorTreiber (IC6.14), MotorTreiber-µC (IC2.14)
NetIC2_15: MotorTreiber (IC6.13), MotorTreiber-µC (IC2.15)
NetIC2_16: MotorTreiber (IC6.9), MotorTreiber-µC (IC2.16)
NetIC2_21: MotorTreiber (X7.3), MotorTreiber-µC (IC2.21 IC2.22)